# EasyEDA Pro project ProPrj_HTXStudio_OneHanded_Keyboard.epro, schematic 轨迹球
Board Name: 3-轨迹球; Create Date: 2025-04-29; Page Name: 轨迹球; Project Name: HTXStudio_OneHanded_Keyboard; Schematic Name: 轨迹球; Update Date: 2025-04-29; Company: 嘉立创EDA; Page Size: A4; Version: V1.0
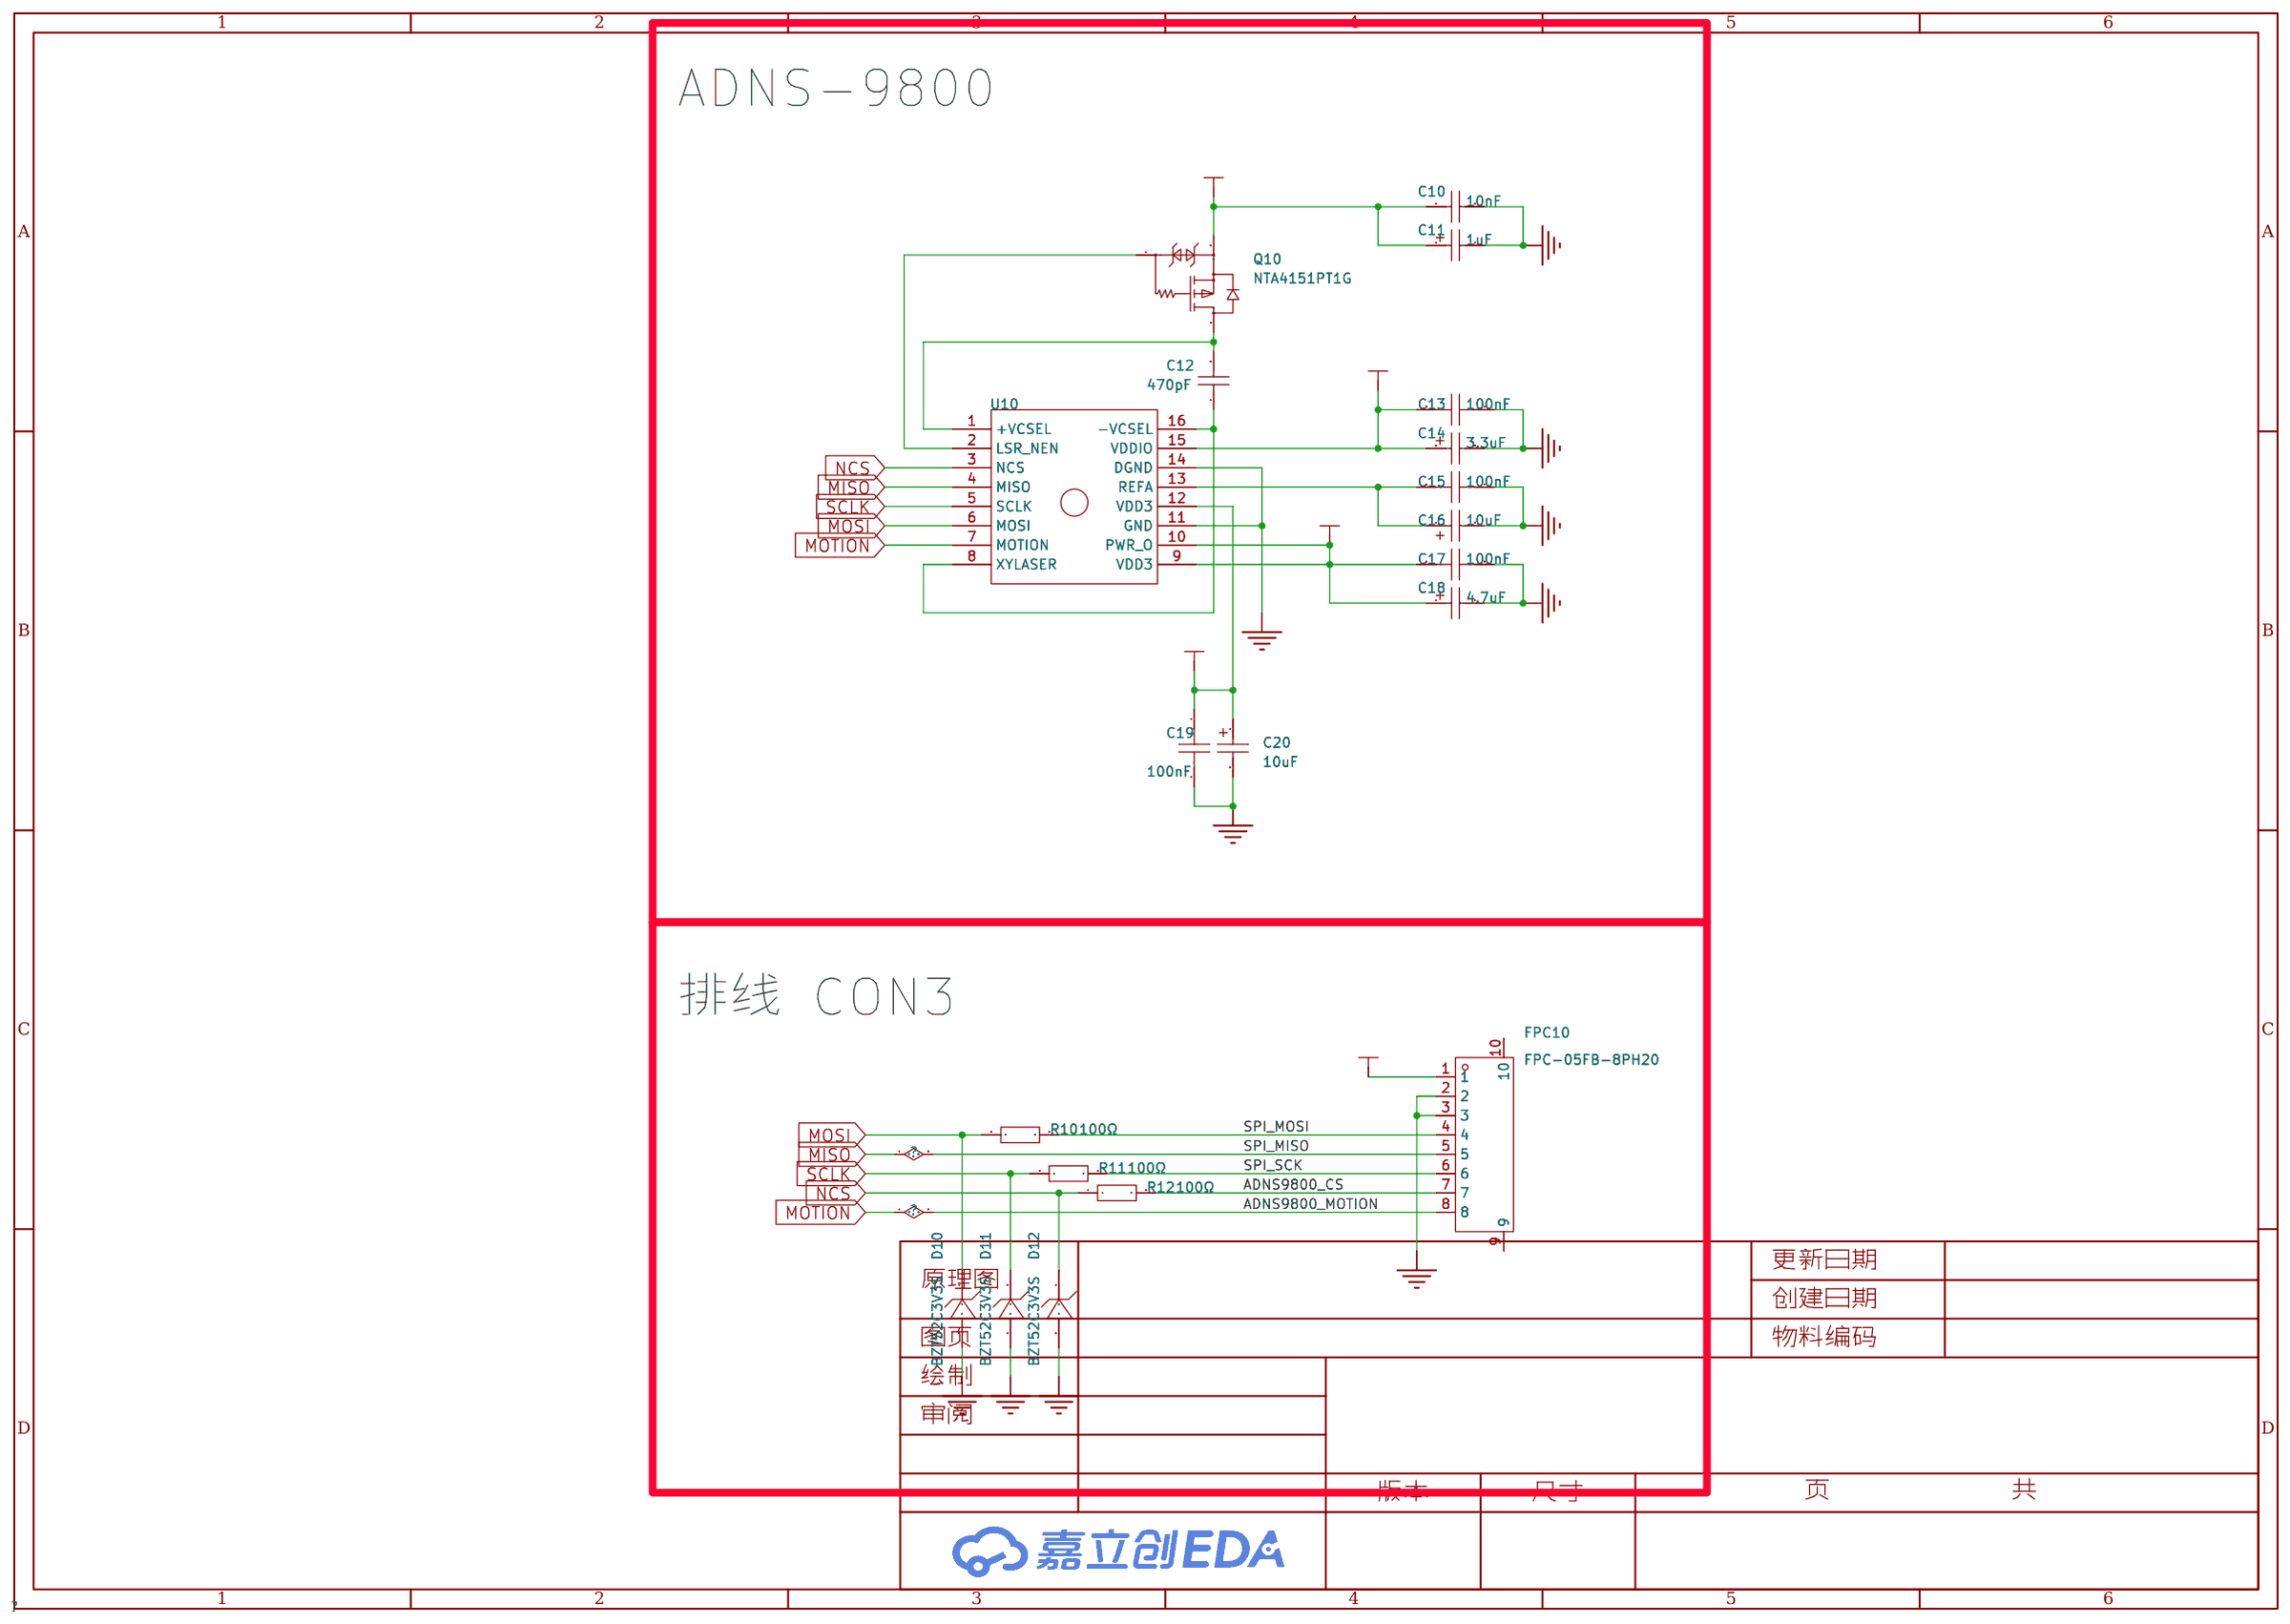
[diagram p3: schematic sheet]

## Parts
C10  10nF  [C0603]
C11  1uF  [CASE-A_3216]
C12  470pF  [C0603]
C13  100nF  [C0603]
C14  3.3uF  [CAP-SMD_L3.2-W1.6-RD-C7171]
C15  100nF  [C0603]
C16  10uF  [CAP-SMD_L3.2-W1.6-RD-C7171]
C17  100nF  [C0603]
C18  4.7uF  [CASE-A_3216]
C19  100nF  [C0603]
C20  10uF  [CAP-SMD_L3.2-W1.6-RD-C7171]
D10  BZT52C3V3S  [SOD-323_L1.8-W1.3-LS2.5-RD]
D11  BZT52C3V3S  [SOD-323_L1.8-W1.3-LS2.5-RD]
D12  BZT52C3V3S  [SOD-323_L1.8-W1.3-LS2.5-RD]
FPC10  FPC-05FB-8PH20  [FPC-SMD_8P-P0.50_XUNPU_FPC-05FB-8PH20]
Q10  NTA4151PT1G  [SOT-416_L1.6-W0.8-P1.00-LS1.6-BR]
R10  100Ω  [R0603]
R11  100Ω  [R0603]
R12  100Ω  [R0603]
U10  -  [ADNS-9800]

## Library data of the parts
C10 = CL10B103KB8NNNC: 容值:10nF;精度:±10%;额定电压:50V;材质(温度系数):X7R;; LCSC Part Name: 10nF ±10% 50V; Supplier Part: C1589; Manufacturer: SAMSUNG(三星); Supplier Footprint: 0603; JLCPCB Part Class: 扩展库; Datasheet: https://atta.szlcsc.com/upload/public/pdf/source/20160218/1457707763339.pdf; Supplier: LCSC; Tolerance: ±10%; Voltage Rated: 50V; Temperature Coefficient: X7R
C11 = TAJA105K016RNJ: 容值:1uF;精度:±10%;额定电压:16V;等效串联电阻:11Ω;; LCSC Part Name: 1uF ±10% 16V; Supplier Part: C7174; Manufacturer: Kyocera AVX; Supplier Footprint: CASE-A-3216; JLCPCB Part Class: 扩展库; Datasheet: https://atta.szlcsc.com/upload/public/pdf/source/20160107/1457707750344.pdf; Supplier: LCSC; Tolerance: ±10%; Rated Voltage: 16V; Equivalent Series Resistance(ESR): 11Ω; Operating Temperature: -55℃~+125℃
C12 = 0603B471K500NT: 容值:470pF;精度:±10%;额定电压:50V;材质(温度系数):X7R;; LCSC Part Name: 470pF ±10% 50V; Supplier Part: C1620; Manufacturer: FH(风华); Supplier Footprint: 0603; JLCPCB Part Class: 基础库; Datasheet: https://atta.szlcsc.com/upload/public/pdf/source/20200305/C486355_26A10D38EF8C2A5C37091D0039909270.pdf; Supplier: LCSC; Tolerance: ±10%; Voltage Rated: 50V; Temperature Coefficient: X7R
C13 C15 C17 C19 = CL10B104KB8NNNC: 容值:100nF;精度:±10%;额定电压:50V;材质(温度系数):X7R;; LCSC Part Name: 100nF ±10% 50V; Supplier Part: C1591; Manufacturer: SAMSUNG(三星); Supplier Footprint: 0603; JLCPCB Part Class: 扩展库; Datasheet: https://atta.szlcsc.com/upload/public/pdf/source/20160218/1457707763339.pdf; Supplier: LCSC; Tolerance: ±10%; Voltage Rated: 50V; Temperature Coefficient: X7R
C14 = TAJA335K016RNJ: 容值:3.3uF;精度:±10%;额定电压:16V;等效串联电阻:5Ω@100kHz;; LCSC Part Name: 3.3uF ±10% 16V; Supplier Part: C7184; Manufacturer: Kyocera AVX; Supplier Footprint: CASE-A-3216; JLCPCB Part Class: 扩展库; Datasheet: https://atta.szlcsc.com/upload/public/pdf/source/20160107/1457707750344.pdf; Supplier: LCSC; Tolerance: ±10%; Rated Voltage: 16V; Equivalent Series Resistance(ESR): 5Ω@100kHz; Operating Temperature: -55℃~+125℃
C16 C20 = TAJA106K016RNJ: 容值:10uF;精度:±10%;额定电压:16V;等效串联电阻:3Ω@100kHz;; LCSC Part Name: 10uF ±10% 16V; Supplier Part: C7171; Manufacturer: Kyocera AVX; Supplier Footprint: CASE-A-3216; JLCPCB Part Class: 基础库; Datasheet: https://atta.szlcsc.com/upload/public/pdf/source/20160107/1457707750344.pdf; Supplier: LCSC; Tolerance: ±10%; Rated Voltage: 16V; Equivalent Series Resistance(ESR): 3Ω@100kHz; Operating Temperature: -55℃~+125℃
C18 = TAJA475K016RNJ: 容值:4.7uF;精度:±10%;额定电压:16V;等效串联电阻:4Ω@100kHz;; LCSC Part Name: 4.7uF ±10% 16V; Supplier Part: C7187; Manufacturer: Kyocera AVX; Supplier Footprint: CASE-A-3216; JLCPCB Part Class: 扩展库; Datasheet: https://atta.szlcsc.com/upload/public/pdf/source/20160107/1457707750344.pdf; Supplier: LCSC; Tolerance: ±10%; Rated Voltage: 16V; Equivalent Series Resistance(ESR): 4Ω@100kHz; Operating Temperature: -55℃~+125℃
D10-D12 = BZT52C3V3S_C173439: 二极管配置:独立式;稳压值(标称值):3.3V;稳压值(范围):3.1V~3.5V;耗散功率(Pd):200mW;; Supplier Part: C173439; Manufacturer: MDD(辰达半导体); Supplier Footprint: SOD-323; JLCPCB Part Class: 扩展库; Datasheet: https://atta.szlcsc.com/upload/public/pdf/source/20241121/729EE6921E2A1D86B761976DA4FF1551.pdf; Supplier: LCSC; Diode Configuration: 独立式; Zener Voltage(Nom): 3.3V; Reverse Leakage Current (Ir): 20uA@1V; Zener Voltage(Range): 3.1V~3.5V; Pd - Power Dissipation(Pd): 200mW; Impedance(Zzt): 130Ω
FPC10 = FPC-05FB-8PH20: 锁定特性:翻盖式;触点类型:双侧触点/上下接;触点数量:8P;间距:0.5mm;安装类型:卧贴;工作温度范围:-25℃~+85℃;; LCSC Part Name: 间距:0.5mm P数:8P 翻盖式 双侧触点/上下接; Supplier Part: C2856828; Manufacturer: XUNPU(讯普); Supplier Footprint: SMD,P=0.5mm,卧贴; JLCPCB Part Class: 扩展库; Datasheet: https://atta.szlcsc.com/upload/public/pdf/source/20210922/C2856828_96968FB666CC1781EEE4F204CBA73B0B.pdf; Supplier: LCSC; Locking Feature: 翻盖式; Contact Type: 双侧触点/上下接; Number of Contacts: 8P; Pitch: 0.5mm; Mounting Type: 卧贴; FFC, FCB Thickness: 0.3mm; Height Above Board: 2mm; Operating Temperature Range: -25℃~+85℃
Q10 = NTA4151PT1G: 类型:P沟道;漏源电压(Vdss):20V;连续漏极电流(Id):760mA;功率(Pd):301mW;导通电阻(RDS(on)@Vgs,Id):360mΩ@4.5V,350mA;阈值电压(Vgs(th)@Id):1.2V@250uA;; LCSC Part Name: P沟道 耐压:20V 电流:760mA; Supplier Part: C54876; Manufacturer: onsemi(安森美); Supplier Footprint: SC-75(SOT-416); JLCPCB Part Class: 扩展库; Datasheet: https://atta.szlcsc.com/upload/public/pdf/source/20150811/1457707341956.pdf; Supplier: LCSC; Type: P沟道; Drain Source Voltage (Vdss): 20V; Continuous Drain Current (Id): 760mA; Power Dissipation (Pd): 301mW; Drain Source On Resistance (RDS(on)@Vgs,Id): 360mΩ@4.5V,350mA; Gate Threshold Voltage (Vgs(th)@Id): 1.2V@250uA; Total Gate Charge (Qg@Vgs): 2.1nC@4.5V; Input Capacitance (Ciss@Vds): 156pF@5V; Operating Temperature: -55℃~+150℃@(Tj)
R10-R12 = 0603WAF1000T5E: 电阻类型:厚膜电阻;阻值:100Ω;精度:±1%;功率:100mW;最大工作电压:75V;温度系数:±200ppm/℃;; LCSC Part Name: 100Ω ±1% 100mW 厚膜电阻; Supplier Part: C22775; Manufacturer: UNI-ROYAL(厚声); Supplier Footprint: 0603; JLCPCB Part Class: 基础库; Datasheet: https://atta.szlcsc.com/upload/public/pdf/source/20200306/C422600_1E6D84923E4A46A82E41ADD87F860B5C.pdf; Supplier: LCSC; Type: 厚膜电阻; Tolerance: ±1%; Power(Watts): 100mW; Overload Voltage (Max): 75V; Temperature Coefficient: ±200ppm/℃; Operating Temperature Range: -55℃~+155℃
U10 = ADNS-9800

## Nets
+3.3V: C10.1 C11.1 C13.2 C14.1 C17.2 C18.1 C19.1 C20.1 FPC10.1 Q10.2(S) U10.9(VDD3) U10.10(PWR_O) U10.12(VDD3) U10.15(VDDIO)
GND: C10.2 C11.2 C13.1 C14.2 C15.1 C16.2 C17.1 C18.2 C19.2 C20.2 D10.2 D11.2 D12.2 FPC10.2 FPC10.3 U10.11(GND) U10.14(DGND)
ADNS9800_CS: FPC10.7 R12.2
ADNS9800_MOTION: FPC10.8 U10.7(MOTION)
MISO: FPC10.5 U10.4(MISO)
MOSI: D10.1 R10.1 U10.6(MOSI)
NCS: D12.1 R12.1 U10.3(NCS)
SCLK: D11.1 R11.1 U10.5(SCLK)
SPI_MOSI: FPC10.4 R10.2
SPI_SCK: FPC10.6 R11.2
$1N1257: C12.1 U10.8(XYLASER) U10.16(-VCSEL)
$1N1258: C12.2 Q10.3(D) U10.1(+VCSEL)
$1N1260: Q10.1(G) U10.2(LSR_NEN)
$1N1262: C15.2 C16.1 U10.13(REFA)

Not connected (* = marked no-connect by the designer): FPC10 9 10

## Notes on the sheet
- ADNS-9800
- 排线 CON3
